# EAGLE design goodfet32 (EAGLE 6.4)
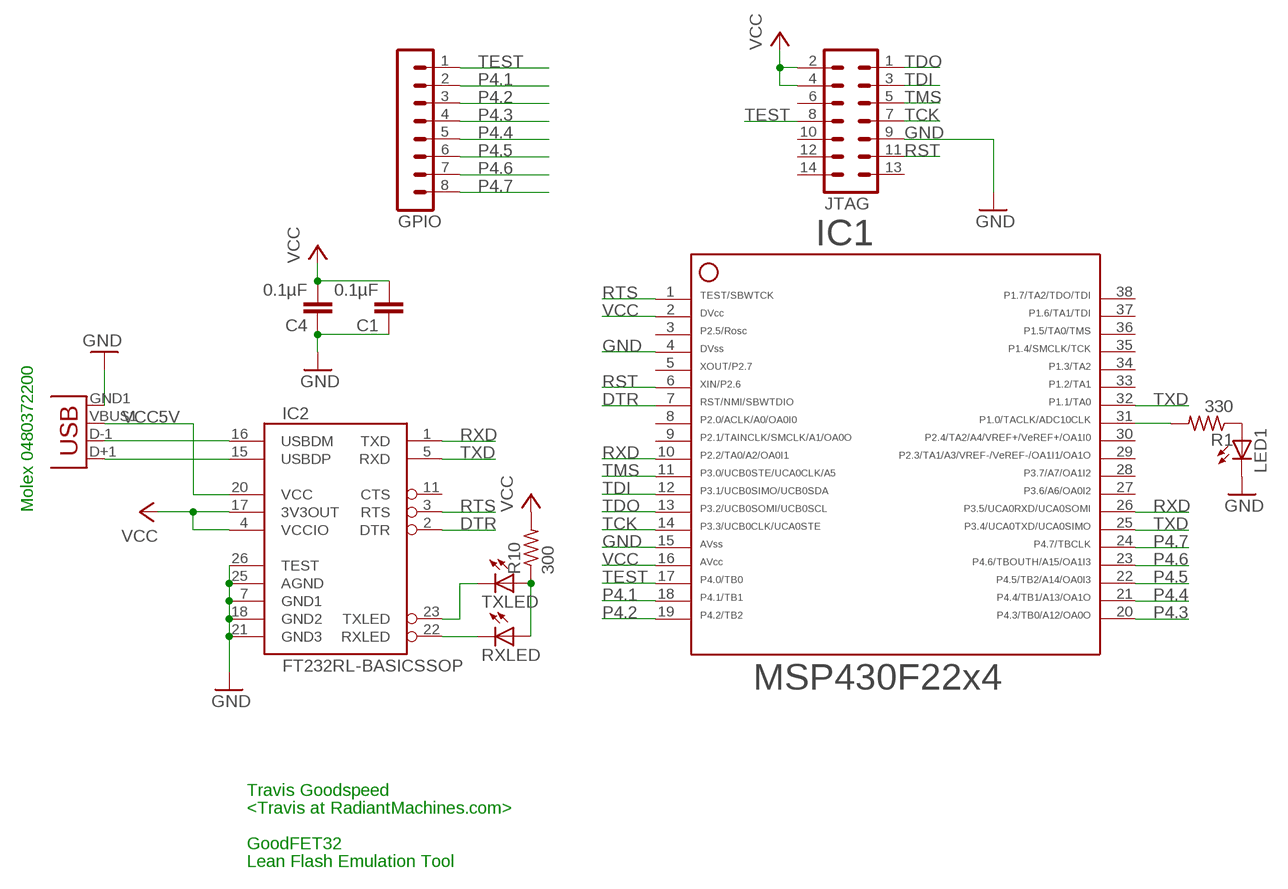
[diagram p0: schematic, sheet 1]

## Parts
C1  0.1µF  C-EUC0603  [C0603]
C4  0.1µF  C-EUC0603  [C0603]
GPIO  MA08-1  [MA08-1]
IC1  F22X4---DA38  [DA38]
IC2  FT232RL-BASICSSOP  [SSOP28DB]
JP1  USBA-SMD-MALE  [USB-A-SMT-MALE]
JTAG  MA07-2  [MA07-2]
LED1  LEDCHIP-LED0603  [CHIP-LED0603]
R1  330  R-US_R0603  [R0603]
R10  300  R-US_R0603  [R0603]
RXLED  LEDCHIP-LED0603  [CHIP-LED0603]
TXLED  LEDCHIP-LED0603  [CHIP-LED0603]

## Nets
DTR: IC1.7 IC2.2(DTR)
GND: C1.1 C4.1 IC1.4 IC1.15 IC2.7(GND1) IC2.18(GND2) IC2.21(GND3) IC2.25(AGND) IC2.26(TEST) JP1.GND1(GND) JTAG.9 LED1.C
N$3: IC2.15(USBDP) JP1.D+1(D+)
N$4: IC2.16(USBDM) JP1.D-1(D-)
N$6: IC2.22(RXLED) RXLED.C
N$7: IC2.23(TXLED) TXLED.C
N$8: R10.1 RXLED.A TXLED.A
N$9: IC1.31 R1.2
N$10: LED1.A R1.1
P4.1: GPIO.2 IC1.18
P4.2: GPIO.3 IC1.19
P4.3: GPIO.4 IC1.20
P4.4: GPIO.5 IC1.21
P4.5: GPIO.6 IC1.22
P4.6: GPIO.7 IC1.23
P4.7: GPIO.8 IC1.24
RST: IC1.6 JTAG.11
RTS: IC1.1 IC2.3(RTS)
RXD: IC1.10 IC1.26 IC2.1(TXD)
TCK: IC1.14 JTAG.7
TDI: IC1.12 JTAG.3
TDO: IC1.13 JTAG.1
TEST: GPIO.1 IC1.17 JTAG.8
TMS: IC1.11 JTAG.5
TXD: IC1.25 IC1.32 IC2.5(RXD)
VCC: C1.2 C4.2 IC1.2 IC1.16 IC2.4(VCCIO) IC2.17(3V3OUT) JTAG.2 JTAG.4 R10.2
VCC5V: IC2.20(VCC) JP1.VBUS1(VBUS)
Unconnected: IC1.3 IC1.5 IC1.8 IC1.9 IC1.27 IC1.28 IC1.29 IC1.30 IC1.33 IC1.34 IC1.35 IC1.36 IC1.37 IC1.38 IC2.11(CTS) JTAG.6 JTAG.10 JTAG.12 JTAG.13 JTAG.14

## Notes on the sheet
- Molex 0480372200
- Travis Goodspeed
- <Travis at RadiantMachines.com>
- GoodFET32
- Lean Flash Emulation Tool

## Library data of the parts
C1 C4 = rcl:C-EU: CAPACITOR, European symbol
GPIO = con-lstb:MA08-1: PIN HEADER
IC1 = TI_MSP430_v13:F22X4---DA38: ***MSP430F22x4***DA38
IC2 = SparkFun:FT232RL-BASIC: USB UART This is the simplified version of the FT232RL unit. Only what you need, nothing you don't. Spark Fun Electronics SKU : COM-00650
JP1 = SparkFun-Connectors:USB: USB Connectors USB-B-PTH is fully proven SKU : PRT-00139/CONN-08278 USB-miniB is fully proven SKU : PRT-00587 USB-A-PCB is untested. USB-A-H is throughly reviewed, but untested. Spark Fun Electronics SKU : PRT-00437 USB-B-SMT is throughly reviewed, but untested. Needs silkscreen touching up. USB-A-S has not been used/tested USB-MB-H has not been used/tested USB-MICROB has been used. CONN-09505
JTAG = con-lstb:MA07-2: PIN HEADER
LED1 RXLED TXLED = led:LED: LED OSRAM: - CHIPLED LG R971, LG N971, LY N971, LG Q971, LY Q971, LO R971, LY R971 LH N974, LH R974 LS Q976, LO Q976, LY Q976 LO Q996 - Hyper CHIPLED LW Q18S LB Q993, LB Q99A, LB R99A - SideLED LS A670, LO A670, LY A670, LG A670, LP A670 LB A673, LV A673, LT A673, LW A673 LH A674 LY A675 LS A676, LA A676, LO A676, LY A676, LW A676 LS A679, LY A679, LG A679 - Hyper Micro SIDELED® LS Y876, LA Y876, LO Y876, LY Y876 LT Y87S - SmartLED LW L88C, LW L88S LB L89C, LB L89S, LG L890 LS L89K, LO L89K, LY L89K LS L896, LA L896, LO L896, LY L896 - TOPLED LS T670, LO T670, LY T670, LG T670, LP T670 LSG T670, LSP T670, LSY T670, LOP T670, LYG T670 LG T671, LOG T671, LSG T671 LB T673, LV T673, LT T673, LW T673 LH T674 LS T676, LA T676, LO T676, LY T676, LB T676, LH T676, LSB T676, LW T676 LB T67C, LV T67C, LT T67C, LS T67K, LO T67K, LY T67K, LW E67C LS E67B, LA E67B, LO E67B, LY E67B, LB E67C, LV E67C, LT E67C LW T67C LS T679, LY T679, LG T679 LS T770, LO T770, LY T770, LG T770, LP T770 LB T773, LV T773, LT T773, LW T773 LH T774 LS E675, LA E675, LY E675, LS T675 LS T776, LA T776, LO T776, LY T776, LB T776 LHGB T686 LT T68C, LB T68C - Hyper Mini TOPLED® LB M676 - Mini TOPLED Santana® LG M470 LS M47K, LO M47K, LY M47K Source: http://www.osram.convergy.de LUXEON: - LUMILED® LXK2-PW12-R00, LXK2-PW12-S00, LXK2-PW14-U00, LXK2-PW14-V00 LXK2-PM12-R00, LXK2-PM12-S00, LXK2-PM14-U00 LXK2-PE12-Q00, LXK2-PE12-R00, LXK2-PE12-S00, LXK2-PE14-T00, LXK2-PE14-U00 LXK2-PB12-K00, LXK2-PB12-L00, LXK2-PB12-M00, LXK2-PB14-N00, LXK2-PB14-P00, LXK2-PB14-Q00 LXK2-PR12-L00, LXK2-PR12-M00, LXK2-PR14-Q00, LXK2-PR14-R00 LXK2-PD12-Q00, LXK2-PD12-R00, LXK2-PD12-S00 LXK2-PH12-R00, LXK2-PH12-S00 LXK2-PL12-P00, LXK2-PL12-Q00, LXK2-PL12-R00 Source: www.luxeon.com KINGBRIGHT: KA-3528ASYC Source: www.kingbright.com
R1 R10 = rcl:R-US_: RESISTOR, American symbol

## Board
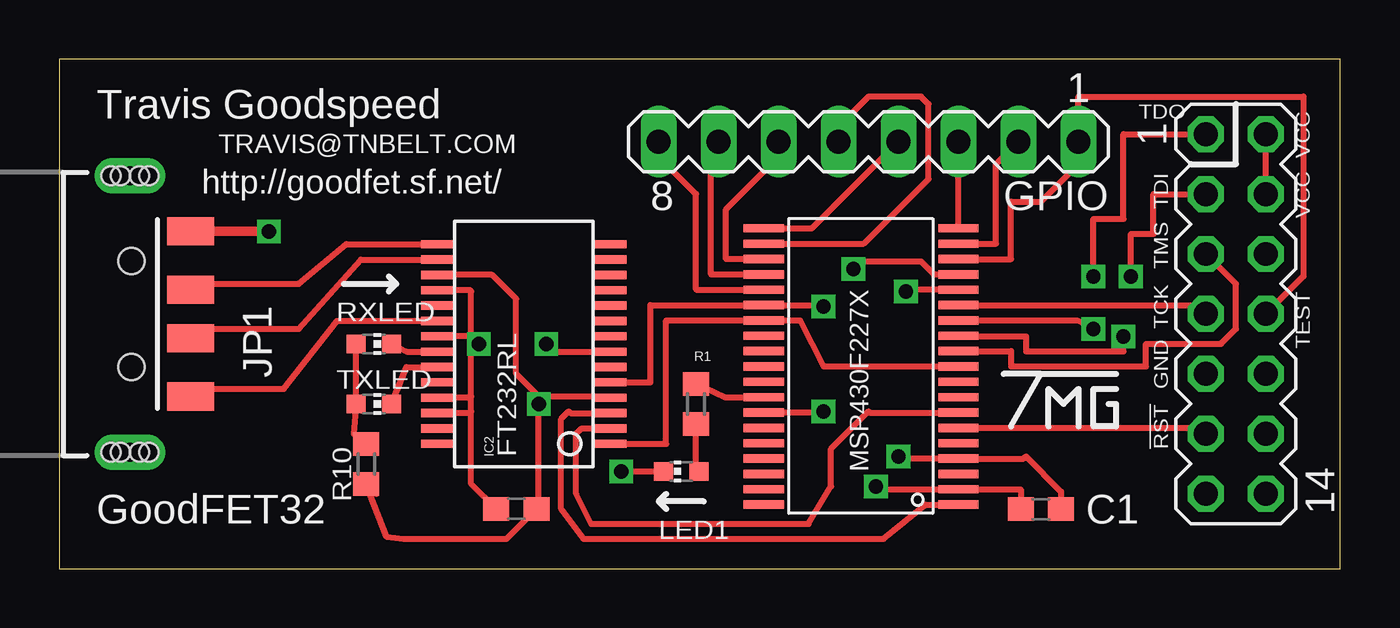
[diagram p1: board, top side]
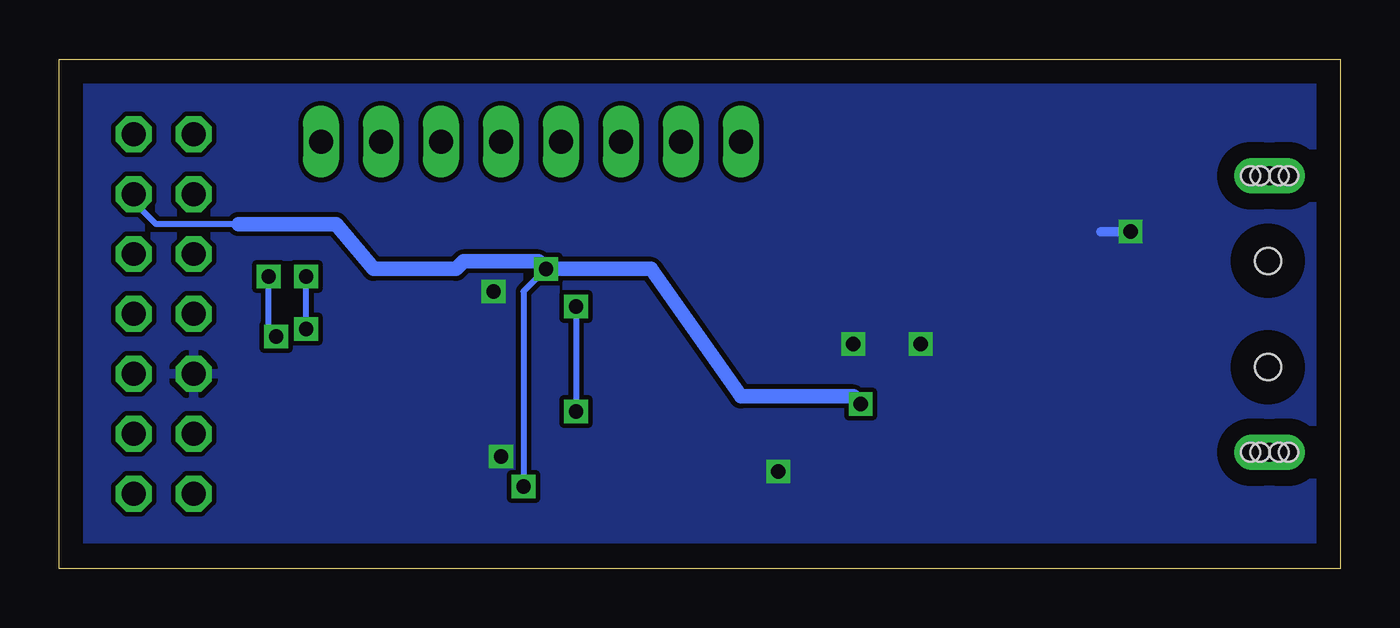
[diagram p2: board, bottom side, seen from below]

Size 54.28 x 21.59 mm. Coordinates in mm from the lower left corner, seen from the top.
Outline: 0,0 54.28,0 54.28,21.59 0,21.59 0,0
Copper layers (1*16): Top 0.035mm / dielectric 1.5mm / Bottom 0.035mm
Design rules "default *": minimum track width 10mil, minimum drill 10mil, track to track 8mil, track to pad 8mil, pad to pad 8mil, via to via 8mil, smd to smd 8mil, copper to edge 40mil, drill to drill 10mil, minimum pad ring 10mil, minimum via ring 8mil, stop-mask expansion 4mil, vias tented up to drill 0mil, thermal gap 10mil

### Footprints (pad centres in the part's own frame; a part is rotated, then mirrored left to right if it is on the bottom)
C0603 = smd 1.1 x 1: 1 -0.85,0; 2 0.85,0
MA08-1 = drill 1.016 long: 1 -8.89,0; 2 -6.35,0; 3 -3.81,0; 4 -1.27,0; 5 1.27,0; 6 3.81,0; 7 6.35,0; 8 8.89,0
DA38 = smd 0.35 x 1.705: 1 -5.85,-4.12; 2 -5.2,-4.12; 3 -4.55,-4.12; 4 -3.9,-4.12; 5 -3.25,-4.12; 6 -2.6,-4.12; 7 -1.95,-4.12; 8 -1.3,-4.12; 9 -0.65,-4.12; 10 0,-4.12; 11 0.65,-4.12; 12 1.3,-4.12; 13 1.95,-4.12; 14 2.6,-4.12; 15 3.25,-4.12; 16 3.9,-4.12; 17 4.55,-4.12; 18 5.2,-4.12; 19 5.85,-4.12; 20 5.85,4.12; 21 5.2,4.12; 22 4.55,4.12; 23 3.9,4.12; 24 3.25,4.12; 25 2.6,4.12; 26 1.95,4.12; 27 1.3,4.12; 28 0.65,4.12; 29 0,4.12; 30 -0.65,4.12; 31 -1.3,4.12; 32 -1.95,4.12; 33 -2.6,4.12; 34 -3.25,4.12; 35 -3.9,4.12; 36 -4.55,4.12; 37 -5.2,4.12; 38 -5.85,4.12
SSOP28DB = smd 0.348 x 1.397: 1 -4.225,-3.656; 2 -3.575,-3.656; 3 -2.925,-3.656; 4 -2.275,-3.656; 5 -1.625,-3.656; 6 -0.975,-3.656; 7 -0.325,-3.656; 8 0.325,-3.656; 9 0.975,-3.656; 10 1.625,-3.656; 11 2.275,-3.656; 12 2.925,-3.656; 13 3.575,-3.656; 14 4.225,-3.656; 15 4.225,3.656; 16 3.575,3.656; 17 2.925,3.656; 18 2.275,3.656; 19 1.625,3.656; 20 0.975,3.656; 21 0.325,3.656; 22 -0.325,3.656; 23 -0.975,3.656; 24 -1.625,3.656; 25 -2.275,3.656; 26 -2.925,3.656; 27 -3.575,3.656; 28 -4.225,3.656
USB-A-SMT-MALE = smd 1.2 x 2: D+1 1.027,-3.67; D-1 -1.027,-3.67; GND1 3.5,-3.67; VBUS1 -3.5,-3.67 | drill 0.8 pad 1.5 long: P$1 5.85,-1.1; P$3 -5.85,-1.1 | hole 1.1: 2.25,-1.17; -2.25,-1.17 | hole 0.8: -5.85,-1.5; -5.85,-1.9; -5.85,-0.7; -5.85,-0.3; 5.85,-1.5; 5.85,-1.9; 5.85,-0.7; 5.85,-0.3
MA07-2 = drill 1.016 octagon: 1 -7.62,-1.27; 2 -7.62,1.27; 3 -5.08,-1.27; 4 -5.08,1.27; 5 -2.54,-1.27; 6 -2.54,1.27; 7 0,-1.27; 8 0,1.27; 9 2.54,-1.27; 10 2.54,1.27; 11 5.08,-1.27; 12 5.08,1.27; 13 7.62,-1.27; 14 7.62,1.27
CHIP-LED0603 = smd 0.8 x 0.8: A 0,-0.75; C 0,0.75
R0603 = smd 1 x 1.1: 1 -0.85,0; 2 0.85,0

### Placement (x,y rotation side)
C1  41.59,2.54 180 top
C4  19.37,2.54 0 top
GPIO  34.29,18.1 180 top
IC1  33.97,8.57 90 top
IC2  19.68,9.52 90 top
JP1  1.91,10.79 90 top
JTAG  49.85,10.79 270 top
LED1  26.35,4.13 90 top
R1  26.99,6.99 90 top
R10  13.02,4.45 270 top
RXLED  13.34,9.52 270 top
TXLED  13.34,6.99 270 top

### Tracks (layer width: path | path; a pad name or v marks a point on that pad's centre or on a via)
DTR
  Top 0.254: IC2.2 22.14,5.95 21.91,5.71 21.91,3.18 22.54,1.91 22.86,1.91 31.75,1.91 32.7,3.49 32.7,5.08 34.29,6.67 34.34,6.62 IC1.7
GND  (via drill 0.6)
  Top 0.254: IC1.15 35.95,11.82 v35.88,11.75 | v35.56,4.76 35.56,4.67 IC1.4 40.87,4.67 40.96,4.76 42.44,3.28 C1.1 | IC2.7 20.64,9.2 v20.64,9.52 | IC2.18 17.41,11.8 17.46,11.75 17.46,9.84 | 17.46,6.67 17.46,3.6 C4.1 | 17.46,6.67 17.46,7.3 | 17.46,7.3 17.46,9.84 | IC2.26 17.39,6.6 17.46,6.67 | IC2.25 17.41,7.25 17.46,7.3 | 17.45,9.85 IC2.21 | 17.46,9.84 17.45,9.85 | 17.45,9.85 17.45,9.53 v17.78,9.52 | v23.81,4.13 LED1.C
  Top 0.406: JP1.GND1 v8.89,14.3 v8.89,14.29
  Bottom 0.254: v35.88,11.75 35.56,11.75 | v35.56,4.76 35.24,4.76 | v20.64,9.52 20.32,9.52 | v17.78,9.52 18.1,9.52
  Bottom 0.406: v8.89,14.29 10.16,14.29
  pour Bottom: 10.79,20.64 53.34,20.96 53.66,1.27 0.64,1.27 0.64,20.64
N$3
  Top 0.254: IC2.15 12.16,13.75 10.16,12.07 5.65,12.07
  Top 0.406: JP1.D+1 5.65,11.82 5.65,12.07
N$4
  Top 0.254: IC2.16 12.78,13.1 10.16,10.16 5.75,10.16
  Top 0.406: JP1.D-1 5.75,9.77 5.75,10.16
N$6
  Top 0.254: IC2.22 14.72,9.2 RXLED.C
N$7
  Top 0.254: IC2.23 14.72,8.55 TXLED.C
N$8
  Top 0.254: RXLED.A TXLED.A 12.48,5.71 R10.1
N$9
  Top 0.254: IC1.31 28.18,7.27 R1.2
N$10
  Top 0.254: R1.1 26.99,4.33 LED1.A
P4.1
  Top 0.254: IC1.18 39.69,13.77 39.69,17.14 GPIO.2
P4.2
  Top 0.254: IC1.19 GPIO.3
P4.3
  Top 0.254: IC1.20 31.89,14.42 GPIO.4
P4.4
  Top 0.254: IC1.21 34.09,13.77 36.83,16.51 36.83,19.69 36.51,20 34.29,20 33.02,18.73 GPIO.5
P4.5
  Top 0.254: IC1.22 28.26,13.12 28.26,15.24 30.48,17.46 GPIO.6
P4.6
  Top 0.254: IC1.23 27.62,12.47 27.62,16.83 GPIO.7
P4.7
  Top 0.254: IC1.24 26.99,11.82 26.99,15.87 25.4,17.46 GPIO.8
RST
  Top 0.254: IC1.6 48.32,5.97 JTAG.11
RTS
  Top 0.254: IC1.1 36.7,2.72 34.92,1.27 22.23,1.27 21.27,2.54 21.27,6.35 21.59,6.67 21.66,6.6 IC2.3
RXD
  Top 0.254: IC1.10 32.38,8.57 31.39,10.52 IC1.26 25.72,10.52 25.72,5.3 IC2.1
TCK
  Top 0.254: IC1.14 48.2,11.17 JTAG.7
TDI  (via drill 0.6)
  Top 0.254: v45.4,12.38 45.4,14.18 46.35,14.18 46.35,15.87 JTAG.3 | IC1.12 38.09,9.84 40.96,9.84 40.96,9.21 45.09,9.21 v45.09,9.84
  Bottom 0.254: v45.4,12.38 45.4,9.84 v45.09,9.84
TDO  (via drill 0.6)
  Top 0.254: v43.81,12.38 43.81,14.82 45.09,14.82 45.09,18.42 JTAG.1 | v43.81,10.16 43.13,10.52 IC1.13
  Bottom 0.254: v43.81,10.16 v43.81,12.38
TEST
  Top 0.254: IC1.17 40.32,13.12 40.32,15.56 41.59,15.56 43.18,17.14 GPIO.1 43.18,20 52.7,20 52.7,12.38 JTAG.8
TMS
  Top 0.254: IC1.11 40.32,9.22 40.32,8.57 46.04,8.57 46.04,9.52 49.21,9.52 49.85,10.16 49.85,12.07 JTAG.5
TXD  (via drill 0.6)
  Top 0.254: IC2.5 25.05,7.9 25.05,11.17 IC1.25 32.07,11.17 v32.38,11.11 | IC1.32 32.07,6.62 v32.38,6.67
  Bottom 0.254: v32.38,11.11 v32.38,6.67
VCC  (via drill 0.6)
  Top 0.254: JTAG.4 JTAG.2 | IC2.4 23.29,7.3 20.32,7.3 | IC2.17 18.35,12.45 19.37,11.43 19.37,8.25 20.32,7.3 | 13.44,3.18 R10.2 13.87,1.37 14.61,1.27 18.95,1.27 C4.2 20.32,2.64 v20.32,6.99 20.32,7.3 | IC1.16 37.06,12.47 36.51,13.02 33.97,13.02 v33.66,12.7 | v34.61,3.49 34.73,3.37 IC1.2 40.74,3.37 C1.2
  Bottom 0.254: JTAG.4 51.12,15.56 50.16,14.6 46.67,14.6 | v34.61,3.49 34.61,11.75 v33.66,12.7
  Bottom 0.61: v20.32,6.99 20.64,7.3 25.4,7.3 29.21,12.7 v33.66,12.7 33.97,13.02 37.15,13.02 37.47,12.7 40.96,12.7 42.55,14.6 46.67,14.6
VCC5V
  Top 0.254: IC2.20 11.77,10.5 9.53,7.62 5.4,7.62 5.21,7.62
  Top 0.406: JP1.VBUS1 5.4,7.29 5.4,7.62

### Text on the board
tPlace: Travis Goodspeed | TRAVIS@TNBELT.COM | GoodFET32
tNames: VCC | TDO | VCC | http://goodfet.sf.net/ | TDI | TMS | TEST | TCK | GND | FT232RL | !RST | MSP430F227X